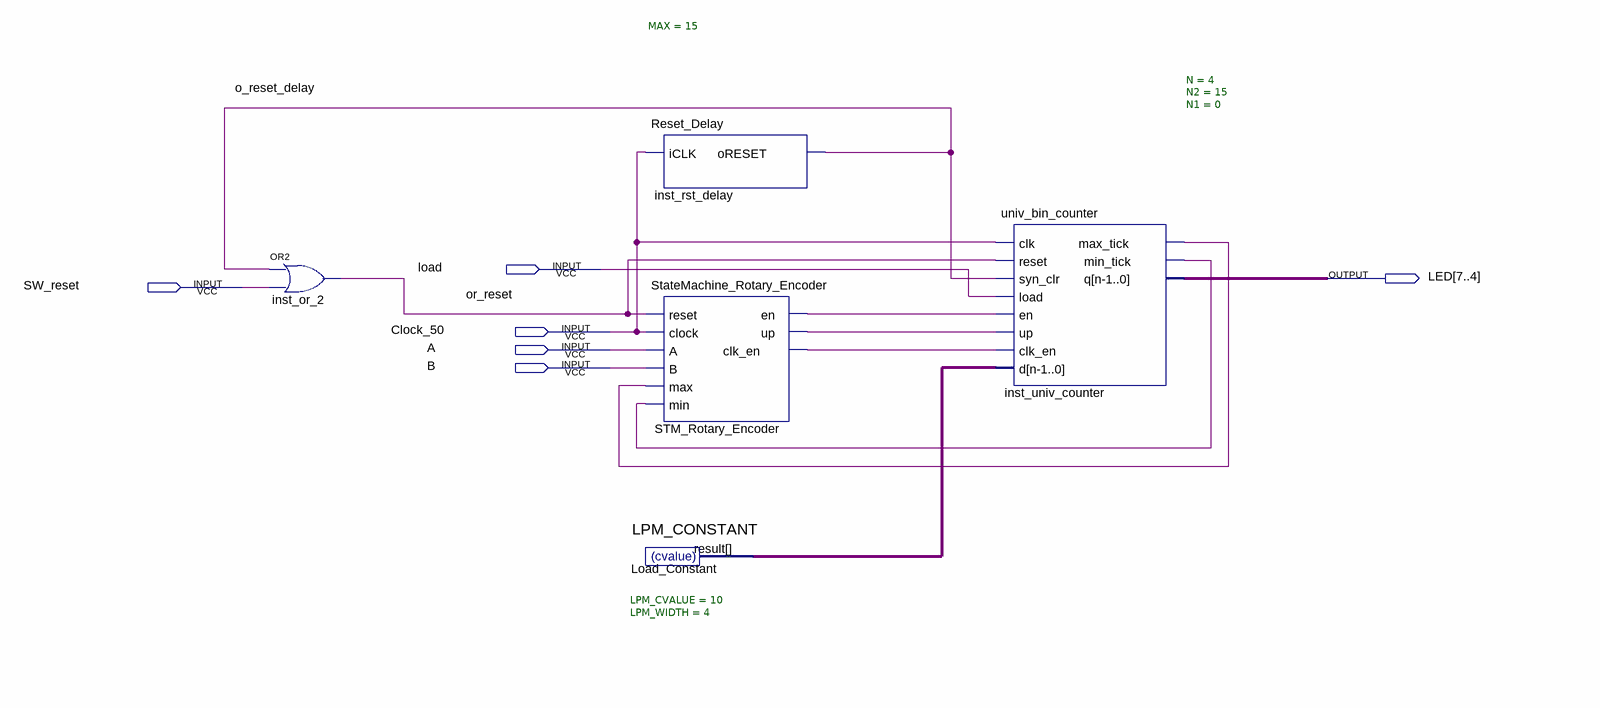
[diagram p0: schematic sheet]
// Quartus schematic Merola_Sola-Thoma_Lab3.bdf as structural Verilog: 5 symbols, 6 pins
module \Merola_Sola-Thoma_Lab3  (
  input  load,
  input  SW_reset,
  input  Clock_50,
  input  A,
  input  B,
  output [7:4] LED
);

  wire inst_univ_counter_max_tick, inst_univ_counter_min_tick, o_reset_delay, or_reset,
       STM_Rotary_Encoder_clk_en, STM_Rotary_Encoder_en, STM_Rotary_Encoder_up;
  wire [3:0] Load_Constant_result;

  or inst_or_2 (or_reset, o_reset_delay, SW_reset);
  Reset_Delay #(.MAX(15)) inst_rst_delay (.iCLK(Clock_50), .oRESET(o_reset_delay));
  StateMachine_Rotary_Encoder STM_Rotary_Encoder (
    .reset(or_reset), .clock(Clock_50), .A(A), .B(B), .max(inst_univ_counter_max_tick),
    .min(inst_univ_counter_min_tick), .en(STM_Rotary_Encoder_en), .up(STM_Rotary_Encoder_up),
    .clk_en(STM_Rotary_Encoder_clk_en));
  LPM_CONSTANT #(.LPM_CVALUE(10), .LPM_WIDTH(4)) Load_Constant (.result(Load_Constant_result));
  univ_bin_counter #(.N(4), .N2(15), .N1(0)) inst_univ_counter (
    .clk(Clock_50), .reset(or_reset), .syn_clr(o_reset_delay), .load(load), .en(STM_Rotary_Encoder_en),
    .up(STM_Rotary_Encoder_up), .clk_en(STM_Rotary_Encoder_clk_en), .d(Load_Constant_result),
    .max_tick(inst_univ_counter_max_tick), .min_tick(inst_univ_counter_min_tick), .q(LED));
endmodule
